# Altium schematic sheet 3.Power.SchDoc
size A3; SheetNumber: 4; SheetTotal: 4
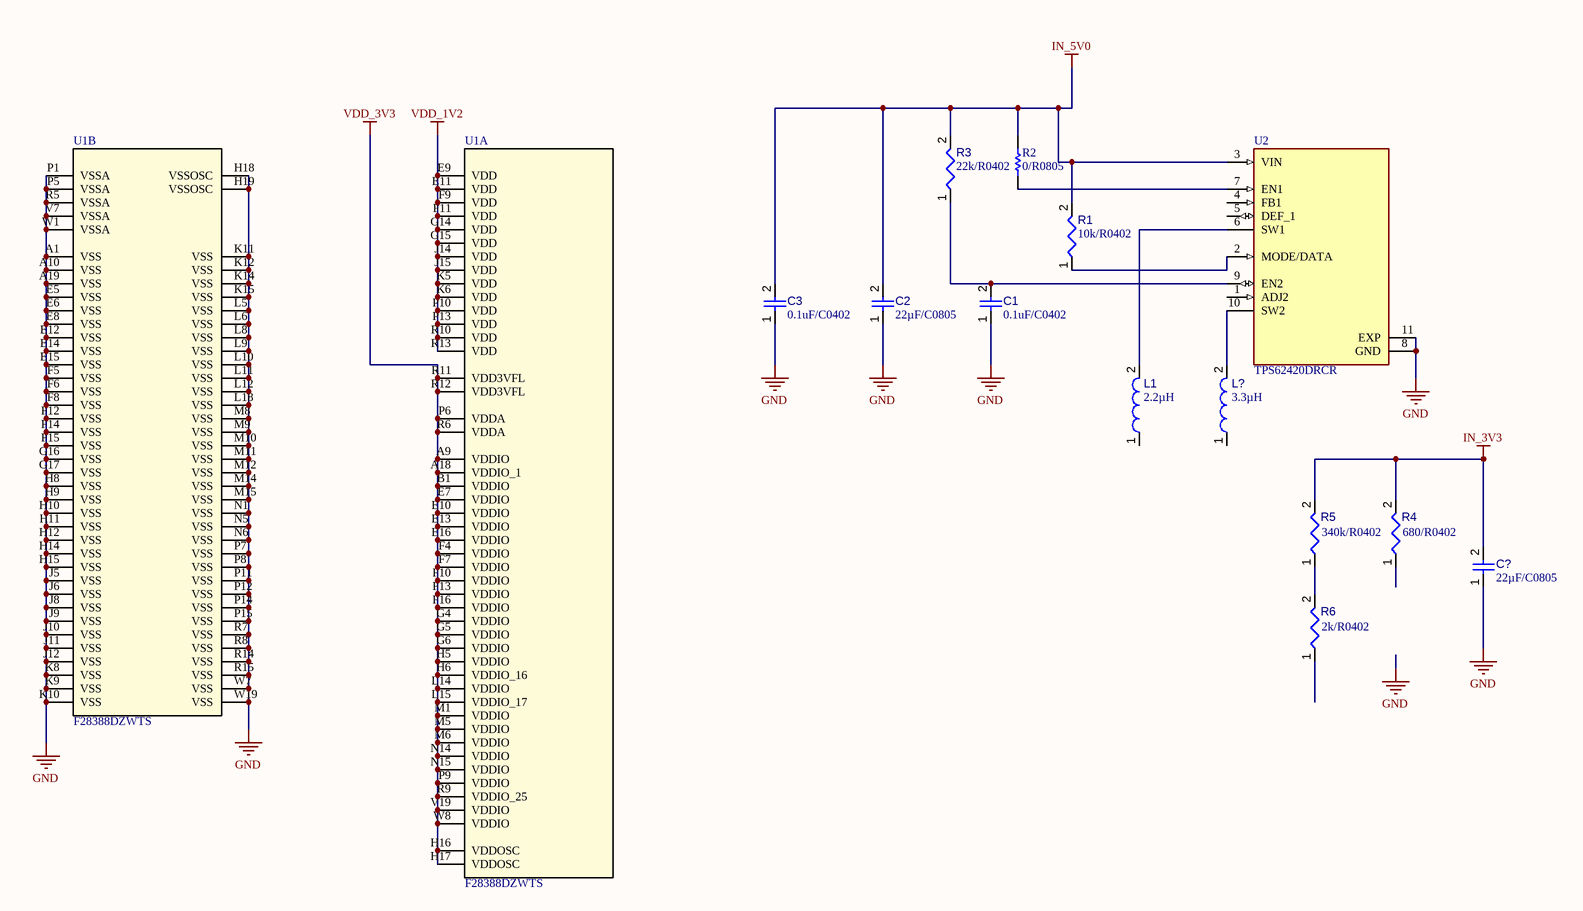
[diagram p0: 3.Power.SchDoc]

## Parts
C1  value 0.1uF/C0402  [CAPC1005X56X25LL10T15]  (hidden comment: Capacitor 0.1 uF +/- 5% 16 V 0402)
C2  value 22µF/C0805  [CAPC0805(2012)145_L]  (hidden comment: Capacitor 22µF +/-40% 16V 0805)
C3  value 0.1uF/C0402  [CAPC1005X56X25LL10T15]  (hidden comment: Capacitor 0.1 uF +/- 5% 16 V 0402)
C?  value 22µF/C0805  [CAPC0805(2012)145_L]  (hidden comment: Capacitor 22µF +/-40% 16V 0805)
L1  value 2.2µH  [INDC2520X100X60NL20T20]  (hidden comment: LQM2HPN2R2MG0L)
L?  value 3.3µH  [INDC2520X100X60NL20T20]  (hidden comment: LQM2HPN2R2MG0L)
R1  value 10k/R0402  [RESC0402(1005)_L]  (hidden comment: 10KR2F)
R2  value 0/R0805  [RESC2013X50X35ML15T15]  (hidden comment: Resistor 0R +/- 1% 0805 125 mW)
R3  value 22k/R0402  [RESC0402(1005)_L]  (hidden comment: 22KR2F)
R4  value 680/R0402  [RESC0402(1005)_L]  (hidden comment: 10KR2F)
R5  value 340k/R0402  [RESC0402(1005)_L]  (hidden comment: 10KR2F)
R6  value 2k/R0402  [RESC0402(1005)_L]  (hidden comment: 10KR2F)
U1  F28388DZWTS  [ZWT0337A-IPC_A]  (parts A,B of 8)
U2  TPS62420DRCR  [IC_TPS62420DRCR]

## Nets
GND: C1.1 C2.1 C3.1 C?.1 U1.A1(VSS) U1.A10(VSS) U1.A19(VSS) U1.E5(VSS) U1.E6(VSS) U1.E8(VSS) U1.E12(VSS) U1.E14(VSS) U1.E15(VSS) U1.F5(VSS) U1.F6(VSS) U1.F8(VSS) U1.F12(VSS) U1.F14(VSS) U1.F15(VSS) U1.G16(VSS) U1.G17(VSS) U1.H8(VSS) U1.H9(VSS) U1.H10(VSS) U1.H11(VSS) U1.H12(VSS) U1.H14(VSS) U1.H15(VSS) U1.H18(VSSOSC) U1.H19(VSSOSC) U1.J5(VSS) U1.J6(VSS) U1.J8(VSS) U1.J9(VSS) U1.J10(VSS) U1.J11(VSS) U1.J12(VSS) U1.K8(VSS) U1.K9(VSS) U1.K10(VSS) U1.K11(VSS) U1.K12(VSS) U1.K14(VSS) U1.K15(VSS) U1.L5(VSS) U1.L6(VSS) U1.L8(VSS) U1.L9(VSS) U1.L10(VSS) U1.L11(VSS) U1.L12(VSS) U1.L18(VSS) U1.M8(VSS) U1.M9(VSS) U1.M10(VSS) U1.M11(VSS) U1.M12(VSS) U1.M14(VSS) U1.M15(VSS) U1.N1(VSS) U1.N5(VSS) U1.N6(VSS) U1.P1(VSSA) U1.P5(VSSA) U1.P7(VSS) U1.P8(VSS) U1.P11(VSS) U1.P12(VSS) U1.P14(VSS) U1.P15(VSS) U1.R5(VSSA) U1.R7(VSS) U1.R8(VSS) U1.R14(VSS) U1.R15(VSS) U1.V7(VSSA) U1.W1(VSSA) U1.W7(VSS) U1.W19(VSS) U2.8(GND) U2.11(EXP)
IN_3V3: C?.2 R4.2 R5.2
IN_5V0: C2.2 C3.2 R1.2 R2.2 R3.2 U2.3(VIN)
VDD_1V2: U1.E9(VDD) U1.E11(VDD) U1.F9(VDD) U1.F11(VDD) U1.G14(VDD) U1.G15(VDD) U1.J14(VDD) U1.J15(VDD) U1.K5(VDD) U1.K6(VDD) U1.P10(VDD) U1.P13(VDD) U1.R10(VDD) U1.R13(VDD)
VDD_3V3: U1.A9(VDDIO) U1.A18(VDDIO_1) U1.B1(VDDIO) U1.E7(VDDIO) U1.E10(VDDIO) U1.E13(VDDIO) U1.E16(VDDIO) U1.F4(VDDIO) U1.F7(VDDIO) U1.F10(VDDIO) U1.F13(VDDIO) U1.F16(VDDIO) U1.G4(VDDIO) U1.G5(VDDIO) U1.G6(VDDIO) U1.H5(VDDIO) U1.H6(VDDIO_16) U1.H16(VDDOSC) U1.H17(VDDOSC) U1.L14(VDDIO) U1.L15(VDDIO_17) U1.M1(VDDIO) U1.M5(VDDIO) U1.M6(VDDIO) U1.N14(VDDIO) U1.N15(VDDIO) U1.P6(VDDA) U1.P9(VDDIO) U1.R6(VDDA) U1.R9(VDDIO_25) U1.R11(VDD3VFL) U1.R12(VDD3VFL) U1.V19(VDDIO) U1.W8(VDDIO)
NetC1_2: C1.2 R3.1 U2.9(EN2)
NetL1_2: L1.2 U2.6(SW1)
NetL?_2: L?.2 U2.10(SW2)
NetR1_1: R1.1 U2.2(MODE/DATA)
NetR2_1: R2.1 U2.7(EN1)
NetR5_1: R5.1 R6.2

Not connected (* = marked no-connect by the designer): L1 1; L? 1; R4 1; R6 1; U2 1(ADJ2) 4(FB1) 5(DEF_1)

## Library data of the parts
C1 C3 = CMP-001-00001-6: Chip Capacitor, 0.1 uF, +/- 5%, 16 V, 0402 (1005 Metric); Capacitor Type: Ceramic; Voltage Rating: 16V; Max Operating Temperature: 125°C; Min Operating Temperature: -55°C; Case/Package: 0402; Mounting Technology: SM; Pins: 2; Tolerance: 5%; RoHS Compliant: True
C2 C? = CMP-001-00081-4: Chip Capacitor, 22µF +/-40%, 16V, 0805, Thickness 1.45 mm; Tolerance: 5%; Voltage Rating: 16V; Mounting Technology: SMT; Pins: 2; Max Operating Temperature: 85°C; Case/Package: 0805; Min Operating Temperature: -55°C
L1 L? = CMP-006-00009-6: Chip Inductor, 2.2 uH, +/- 20%, -55 to 125 degC, 1008 (2520 Metric), RoHS, Tape and Reel; Manufacturer: Murata; Self Resonant Frequency: 40MHz; Current Rating: 1.3A; Core Material: Ferrite; Shielding: Shielded; Package Description: 2-Pin Surface Mounted Device, Body 2.5 x 2 mm; Tolerance: 20%; Max Operating Temperature: 125°C; Mounting Technology: SM; Package Reference: 1008; Case/Package: 1008; RoHS Compliant: True; Package Quantity: 3000; Packaging: TapeandReel; Min Operating Temperature: -55°C; Datasheet URL: http://psearch.en.murata.com/inductor/product/LQM2HPN2R2MG0%23.pdf; Datasheet Version: Aug-16
R1 R4-R6 = CMP-009-00066-2: 10K 0.063W 1% 0402 (1005 Metric)  SMD; Power: 63mW; Case/Package: 0402; Mounting Technology: SMT; Pins: 2; Tolerance: 1%
R2 = CMP-009-00001-5: Chip Resistor, 0 Ohm, +/- 1%, 125 mW, -55 to 155 degC, 0805 (2012 Metric); Voltage Rating: 150V; Power: 125mW; Mounting Technology: SM; Max Operating Temperature: 155°C; Case/Package: 0805; RoHS Compliant: True; Pins: 2; Min Operating Temperature: -55°C; Tolerance: 1%
R3 = CMP-009-00081-2: 22K 0.063W 1% 0402 (1005 Metric)  SMD; Power: 63mW; Tolerance: 1%; Pins: 2; Mounting Technology: SMT; Case/Package: 0402
U1 = F28388DZWTS: C2000â„¢ 32-bit MCU w/ connectivity manager, 2x C28x+CLA CPU, 1.5-MB flash, FPU64, CLB, ENET, EtherCAT 337-NFBGA -40 to 125; Manufacturer_Name: Texas Instruments; TYPE: TYPE; RefDes: RefDes; Copyright: Copyright (C) 2025 Ultra Librarian. All rights reserved.; Manufacturer_Part_Number: F28388DZWTS
U2 = CMP-030-000000-1: TPS62420DRCR – Dual Step-Down DC-DC Converter (Texas Instruments) / This component is a high-efficiency dual synchronous step-down converter designed for low-power portable applications. It integrates two 600-mA regulators with automatic PWM/PFM mode selection to optimize efficiency across the entire load range. The device supports input voltages from 2.5 V to 5.5 V and provides fixed-output options suitable for powering digital ICs, RF modules, sensors, and other low-voltage subsystems. Its small 3 × 3 mm VSON package and fast transient response make it well suited for compact, battery-powered designs.; Value: *; SnapEDA_Link: https://www.snapeda.com/parts/TPS62420DRCR/Texas+Instruments/view-part/?ref=snap; Design Item ID: TPS62420DRCR; MP: TPS62420DRCR; Check_prices: https://www.snapeda.com/parts/TPS62420DRCR/Texas+Instruments/view-part/?ref=eda; Source: TPS62420DRCR.SchLib; Package: VSON-10 Texas Instruments; MF: Texas Instruments